# Altium schematic sheet rf-mixer.SchDoc: RF Mixer 2-14GHz [Master]
size A4; DocumentNumber: 1; SheetNumber: 1; SheetTotal: 1
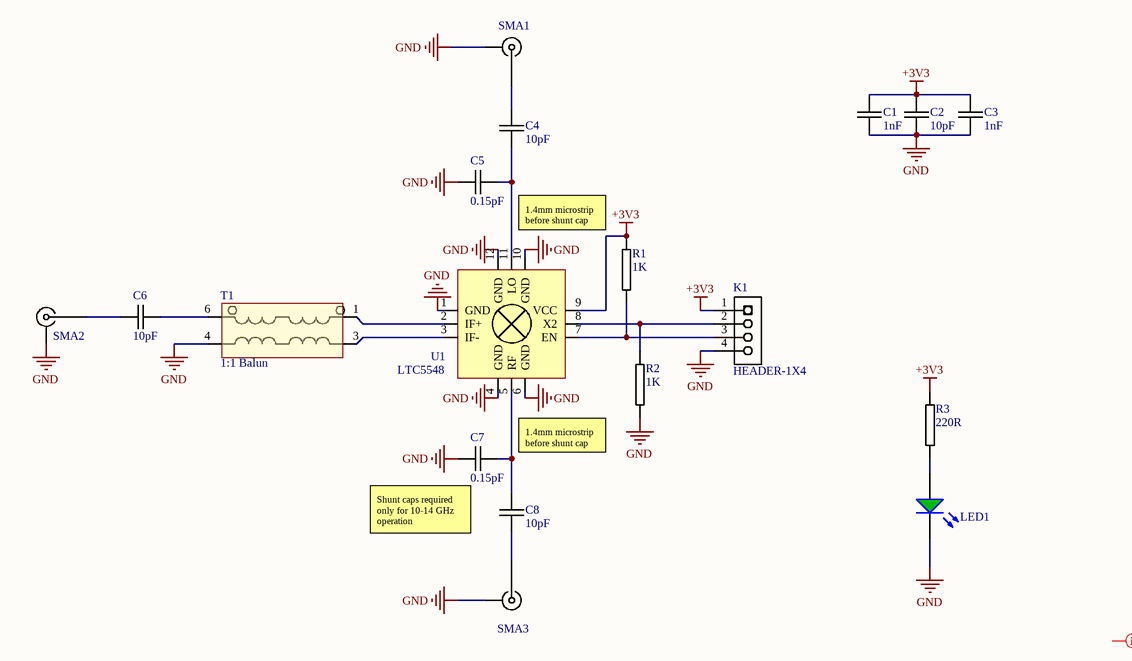
[diagram p0: rf-mixer.SchDoc]

## Parts
C1  1nF  [0603C-GENERIC]
C2  10pF  [0603C-GENERIC]
C3  1nF  [0603C-GENERIC]
C4  10pF  [0603C-GENERIC]
C5  0.15pF  [0603C-GENERIC]
C6  10pF  [0603C-GENERIC]
C7  0.15pF  [0603C-GENERIC]
C8  10pF  [0603C-GENERIC]
K1  HEADER-1X4  [HEADER-1X4]
LED1  Green  [0805LED - GREEN]  (value not drawn)
R1  1K  [0603R-1k]
R2  1K  [0603R-1k]
R3  220R  [0603R-220]
SMA1  *  [MOLEX_SMA_EDGE]  (value not drawn)
SMA2  *  [MOLEX_SMA_EDGE]  (value not drawn)
SMA3  *  [MOLEX_SMA_EDGE]  (value not drawn)
T1  1:1 Balun  [TC1-1-13M+_FOOTPRINT]
U1  LTC5548  [LTC5548_QFN3mmx2mm]

## Nets
+3V3: C1.2 C2.2 C3.2 K1.1 R1.2 R3.1 U1.9(VCC)
GND: C1.1 C2.1 C3.1 C5.1 C7.1 K1.4 LED1.K R2.1 SMA1.2 SMA2.2 SMA3.2 T1.4(GND) U1.1(GND) U1.4(GND) U1.6(GND) U1.10(GND) U1.12(GND)
NetC4_1: C4.1 C5.2 U1.11(LO)
NetC4_2: C4.2 SMA1.1
NetC6_1: C6.1 T1.6(GND)
NetC6_2: C6.2 SMA2.1
NetC7_2: C7.2 C8.2 U1.5(RF)
NetC8_1: C8.1 SMA3.1
NetK1_2: K1.2 R2.2 U1.8(X2)
NetK1_3: K1.3 R1.1 U1.7(EN)
NetLED1_A: LED1.A R3.2
NetT1_1: T1.1(GND) U1.2(IF+)
NetT1_3: T1.3(GND) U1.3(IF-)

## Layout directives
net class POWER: (no net found under the mark)

## Notes on the sheet
- 1.4mm microstrip before shunt cap
- Shunt caps required only for 10-14 GHz operation
- Title:
- Date:
- Sheet:
- of
- File:

## Library data of the parts
C1 C3 = 0603C-1NF-50V-X7R: CAPACITOR 0603 CERAMIC
C2 C4 C6 C8 = 0603C-10PF-50V-C0G-MUR: CAPACITOR 0603 CERAMIC; Reel: C2
C5 C7 = 0603C-0.15PF-50V-C0G: CAPACITOR 0603 CERAMIC; Reel: C2
LED1 = 0805 SMD LED - GREEN: Supplier 1: Digi-Key; Supplier Part Number 1: 160-1426-1-ND
R1 R2 = 0603R-1K: GENERIC RESISTOR 0603; Manufacturer Part Number: RMCF 1/16 1K 1% R; Manufacturer: Stackpole Electronics Inc; Reel: R14; Supplier 1: Digi-Key; Supplier Part Number 1: RMCF0603FT1K00TR-ND
R3 = 0603R-220: GENERIC RESISTOR 0603; Manufacturer: Stackpole Electronics Inc; Manufacturer Part Number: RMCF 1/16 220 1% R; Resistance In Ohms: 220; Power (Watts): 0.1W, 1/10W; Tolerance: ±1%; Temperature Coefficient: ±100ppm/°C; Supplier 1: Digi-Key; Supplier Part Number 1: RMCF1/16220FRCT-ND; Lead Style: Surface Mount (SMD - SMT); Case: 0603 (1608 metric); RoHS: RoHS Compliant; Supplier: Digi-Key; Packaging: Cut Tape (CT); Composition: Thick Film; Supplier Part Number: RMCF1/16220FRCT-ND; Category: Resistors
SMA1-SMA3 = MOLEX_SMA_EDGE: Supplier 1: Digi-Key; Supplier Part Number 1: WM5534-ND
T1 = TC1-1-13M+ 1:1 RF Balun
K1 = HEADER-1X4: Supplier 1: Digi-Key; Supplier Part Number 1: S1011E-36-ND
U1 = LTC5548: Supplier 1: Digi-Key; Supplier Part Number 1: LTC5548IUDB#TRMPBFCT-ND